# EAGLE design CurrentAmp (EAGLE 9.2.1)
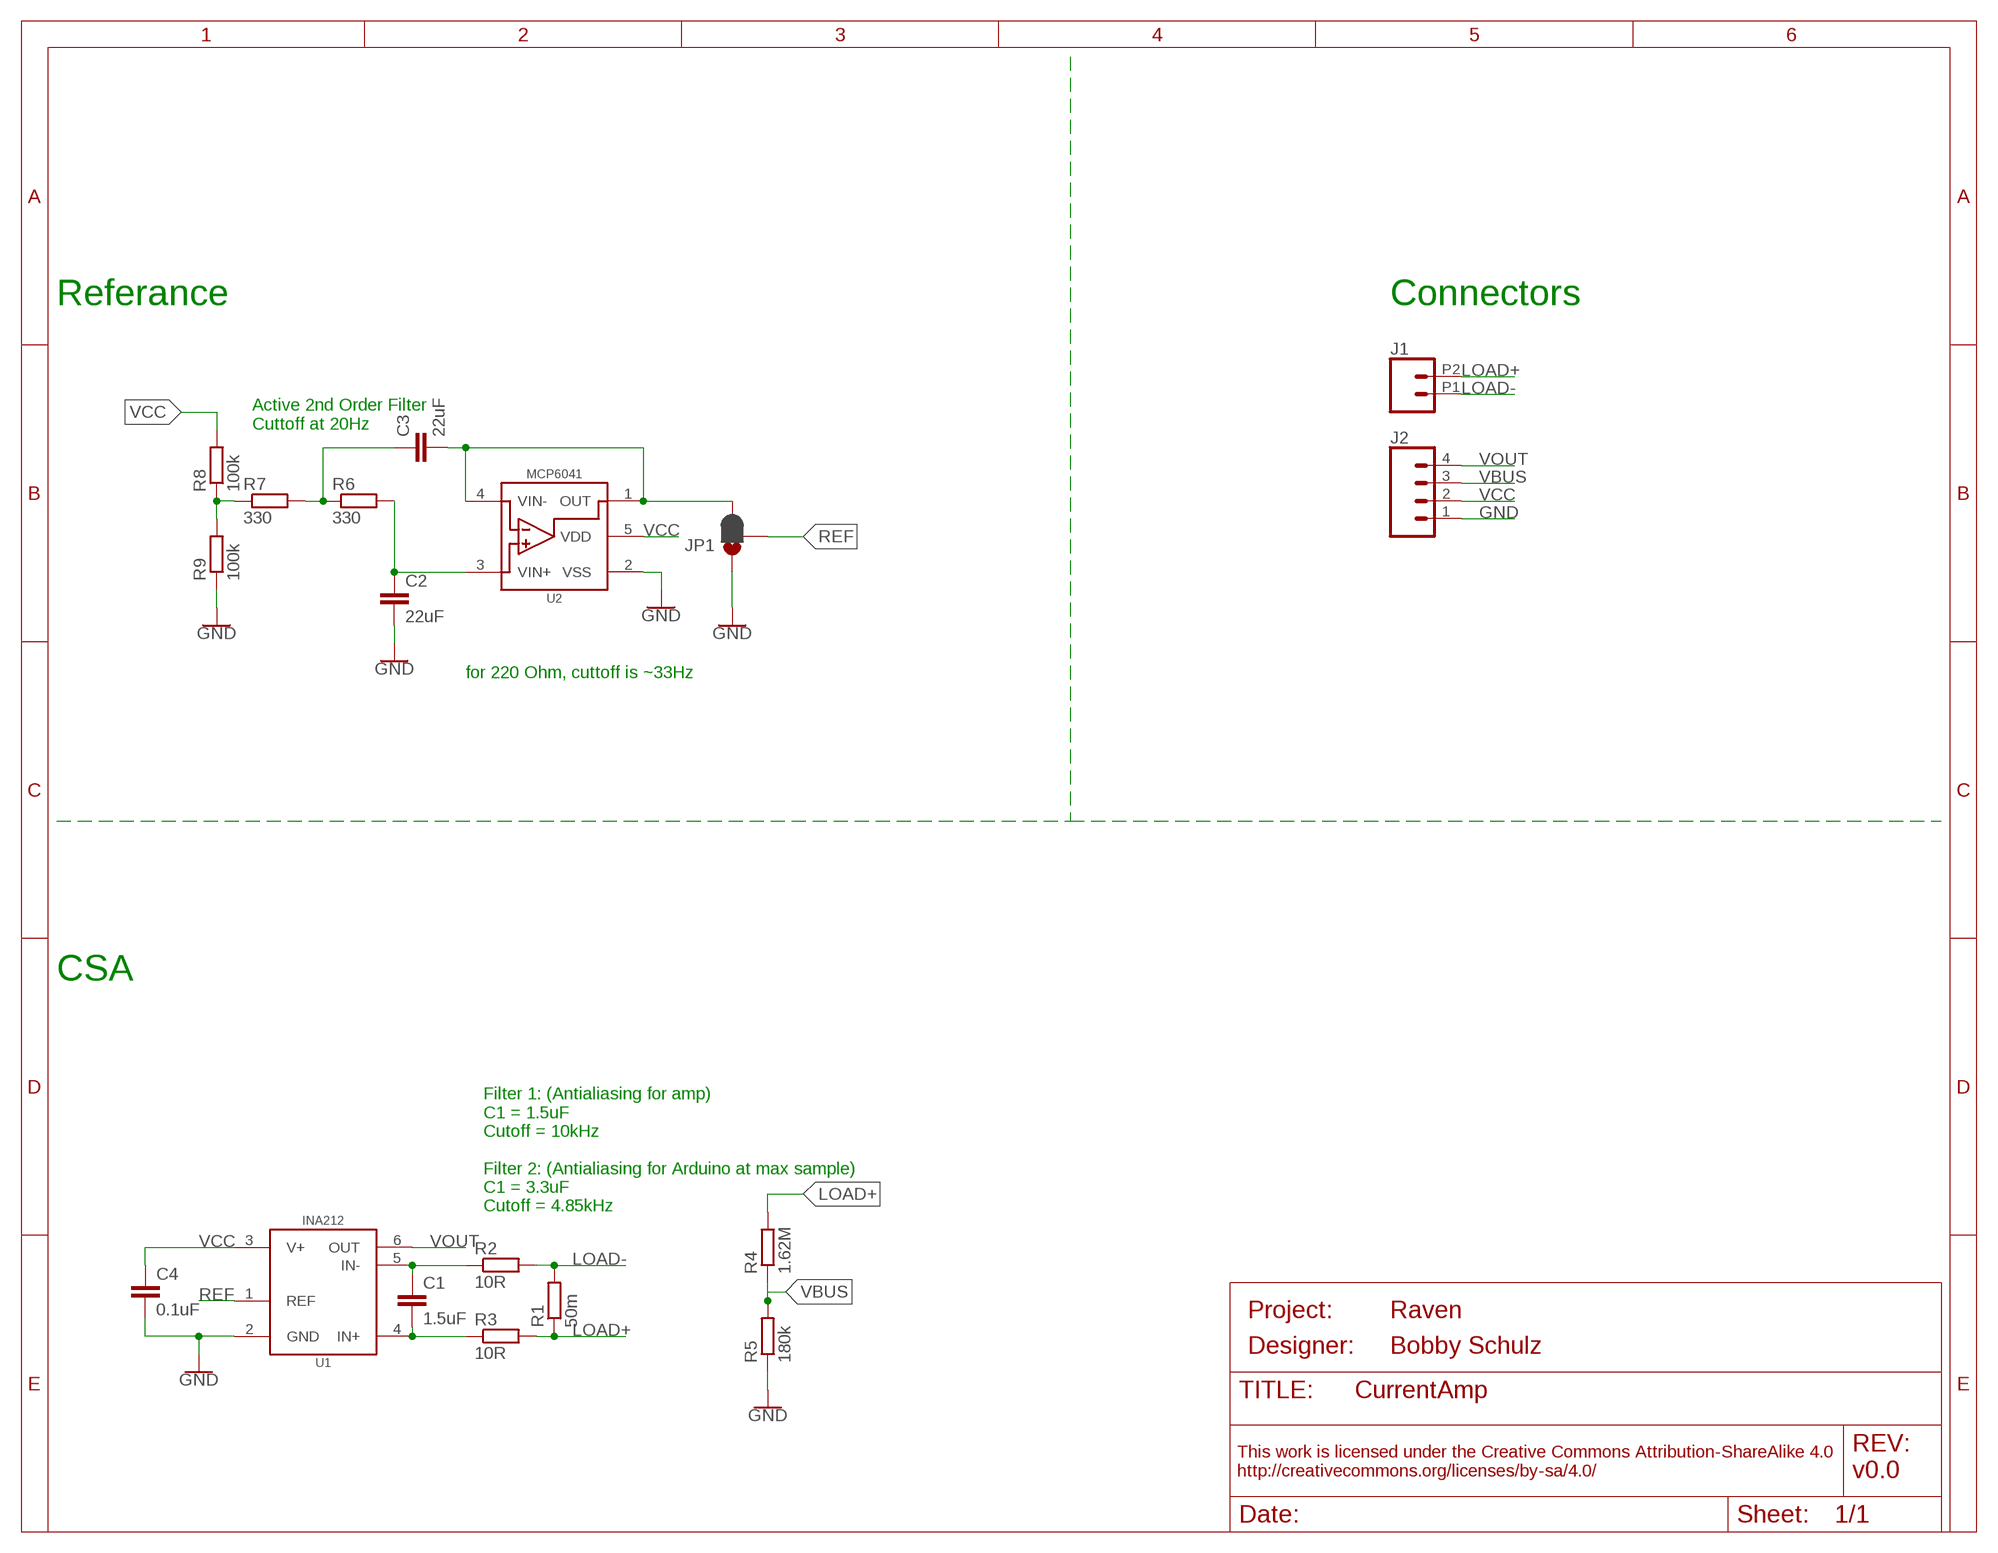
[diagram p0: schematic, sheet 1]
FRAME1 (FRAME_A_L): DESIGNER: Bobby Schulz; PROJECT: Raven; REV: v0.0

## Parts
C1  1.5uF  C-EUC0603  [C0603]
C2  22uF  C-EUC0805  [C0805]
C3  22uF  C-EUC0805  [C0805]
C4  0.1uF  C-EUC0603  [C0603]
J1  CONN_022.54MM_SCREWTERM  [1X02_2.54_SCREWTERM]
J2  CONN_42.54_SCREW  [1X04_SCREW]
JP1  JUMPER-SMT_3_1-NC_PASTE_SILK  [SMT-JUMPER_3_1-NC_PASTE_SILK]
R1  50m  R-EU_R0805  [R0805]
R2  10R  R-EU_R0603  [R0603]
R3  10R  R-EU_R0603  [R0603]
R4  1.62M  R-EU_R0603  [R0603]
R5  180k  R-EU_R0603  [R0603]
R6  330  R-EU_R0603  [R0603]
R7  330  R-EU_R0603  [R0603]
R8  100k  R-EU_R0603  [R0603]
R9  100k  R-EU_R0603  [R0603]
U1  INA212DCK  [DCK_R-PDSO-G6]
U2  MCP6041  [SOT23-5]

## Nets
GND: C2.2 C4.2 J2.1 JP1.1 R5.1 R9.1 U1.2(GND) U2.2(VSS)
LOAD+: J1.P2 R1.1 R3.2 R4.2
LOAD-: J1.P1 R1.2 R2.2
N$1: C1.1 R2.1 U1.5(IN-)
N$2: C1.2 R3.1 U1.4(IN+)
N$3: C3.2 JP1.3 U2.1(OUT) U2.4(VIN-)
N$4: C2.1 R6.2 U2.3(VIN+)
N$5: C3.1 R6.1 R7.2
N$6: R7.1 R8.1 R9.2
REF: JP1.2 U1.1(REF)
VBUS: J2.3 R4.1 R5.2
VCC: C4.1 J2.2 R8.2 U1.3(V+) U2.5(VDD)
VOUT: J2.4 U1.6(OUT)

## Notes on the sheet
- Referance | Connectors
- Active 2nd Order Filter
  Cuttoff at 20Hz
- for 220 Ohm, cuttoff is ~33Hz
- CSA
- Filter 1: (Antialiasing for amp)
  C1 = 1.5uF
  Cutoff = 10kHz 
  
  Filter 2: (Antialiasing for Arduino at max sample)
  C1 = 3.3uF
  Cutoff = 4.85kHz

## Library data of the parts
C1-C4 = bschulz_passives:C-EU: CAPACITOR, European symbol
J1 = SparkFun-Connectors:CONN_02: Multi connection point. Often used as Generic Header-pin footprint for 0.1 inch spaced/style header connections On any of the 0.1 inch spaced packages, you can populate with these: Break Away Headers - Straight <https://www.sparkfun.com/products/116> (PRT-00116) Break Away Male Headers - Right Angle <https://www.sparkfun.com/products/553> (PRT-00553) Female Headers <https://www.sparkfun.com/products/115> (PRT-00115) Break Away Headers - Machine Pin <https://www.sparkfun.com/products/117> (PRT-00117) Break Away Female Headers - Swiss Machine Pin <https://www.sparkfun.com/products/743> (PRT-00743) For SCREWTERMINALS and SPRING TERMINALS visit here: Screw Terimnals on SparkFun.com <https://www.sparkfun.com/search/results?term=Screw+Terminals> (5mm/3.5mm/2.54mm spacing) This device is also useful as a general connection point to wire up your design to another part of your project. Our various solder wires solder well into these plated through hole pads. Hook-Up Wire - Assortment (Stranded, 22 AWG) <https://www.sparkfun.com/products/11375> (PRT-11375) Hook-Up Wire - Assortment (Solid Core, 22 AWG) <https://www.sparkfun.com/products/11367> (PRT-11367) View the entire wire category on our website here <https://www.sparkfun.com/categories/141> Special notes: Molex polarized connector foot print use with: PRT-08233 with associated crimp pins and housings. 2.54_SCREWTERM for use with PRT-10571. 3.5mm Screw Terminal footprints for PRT-08084 5mm Screw Terminal footprints for use with PRT-08432
J2 = bschulz:CONN_4: Genaric 4 pin connector; DIGIKEY: ED10563-ND; MF: On Shore; MPN: OSTVN04A150
JP1 = SparkFun-Jumpers:JUMPER-SMT_3_1-NC_PASTE: Normally closed solder jumper (1 of 2 connections) This jumper has an aperture in the stencil to allow solder paste to bridge one of the two connections. One connection is normally closed (NC), while the other is normally open (NO). Wick off the solder to open the connection. Reapply solder to reclose the connection. Apply solder to the other side instead to change the current path.
R1 = bschulz_passives:R-EU_: RESISTOR, European symbol Digikey Parts: Yageo, 0402 <https://www.digikey.com/products/en/resistors/chip-resistor-surface-mount/52?k=&pkeyword=&sf=0&FV=ffec1104%2Cfffc000d%2C1c0002%2C440067%2C1f140000%2Cffe00034%2C400004&quantity=&ColumnSort=0&page=1&stock=1&pageSize=25> Yageo, 0603 <https://www.digikey.com/products/en/resistors/chip-resistor-surface-mount/52?k=&pkeyword=&s=4356&s=47360&sf=0&FV=fffc000d%2C1c0002%2C142c040c%2C1f140000%2Cffe00034&quantity=10&ColumnSort=1000011&page=1&stock=1&pageSize=25> Panasonic, 0603 <https://www.digikey.com/products/en/resistors/chip-resistor-surface-mount/52?k=&pkeyword=&pv252=68&sf=0&FV=ffec373d%2C1c0002%2C142c040c%2C1f140000%2Cffe00034%2C80002%2Cc0001&quantity=&ColumnSort=0&page=1&stock=1&pageSize=25> Panasonic, precision, 0603 <https://www.digikey.com/products/en/resistors/chip-resistor-surface-mount/52?FV=ffec4907%2Cfffc000a%2Cc0172%2C142c040c%2C1f140000%2Cffe00034%2C1c0002&quantity=100&ColumnSort=2085&page=1&stock=1&pageSize=25> Panasonic, 0805 <https://www.digikey.com/products/en/resistors/chip-resistor-surface-mount/52?k=&pkeyword=&pv3=1&sf=0&FV=ffec373d%2C1c0002%2C1f140000%2Cffe00034%2C142c040d&quantity=&ColumnSort=0&page=1&stock=1&pageSize=25> Rohm, current sense <https://www.digikey.com/products/en/resistors/chip-resistor-surface-mount/52?k=&pkeyword=&pv3=1&sf=0&FV=ffecb688%2C1f140000%2Cffe00034%2C1c0002&quantity=&ColumnSort=0&page=1&stock=1&pageSize=25> Vishay, pulse proof automotive <https://www.digikey.com/products/en/resistors/chip-resistor-surface-mount/52?k=&pkeyword=&pv7=2&sf=0&FV=ffec5d6b%2Cffe00034%2C1f140000&quantity=&ColumnSort=0&page=1&stock=1&pageSize=25>
R2-R9 = bschulz_passives:R-EU_: RESISTOR, European symbol Digikey Parts: Yageo, 0402 <https://www.digikey.com/products/en/resistors/chip-resistor-surface-mount/52?k=&pkeyword=&sf=0&FV=ffec1104%2Cfffc000d%2C1c0002%2C440067%2C1f140000%2Cffe00034%2C400004&quantity=&ColumnSort=0&page=1&stock=1&pageSize=25> Yageo, 0603 <https://www.digikey.com/products/en/resistors/chip-resistor-surface-mount/52?k=&pkeyword=&s=4356&s=47360&sf=0&FV=fffc000d%2C1c0002%2C142c040c%2C1f140000%2Cffe00034&quantity=10&ColumnSort=1000011&page=1&stock=1&pageSize=25> Panasonic, 0603 <https://www.digikey.com/products/en/resistors/chip-resistor-surface-mount/52?k=&pkeyword=&pv252=68&sf=0&FV=ffec373d%2C1c0002%2C142c040c%2C1f140000%2Cffe00034%2C80002%2Cc0001&quantity=&ColumnSort=0&page=1&stock=1&pageSize=25> Panasonic, precision, 0603 <https://www.digikey.com/products/en/resistors/chip-resistor-surface-mount/52?FV=ffec4907%2Cfffc000a%2Cc0172%2C142c040c%2C1f140000%2Cffe00034%2C1c0002&quantity=100&ColumnSort=2085&page=1&stock=1&pageSize=25> Panasonic, 0805 <https://www.digikey.com/products/en/resistors/chip-resistor-surface-mount/52?k=&pkeyword=&pv3=1&sf=0&FV=ffec373d%2C1c0002%2C1f140000%2Cffe00034%2C142c040d&quantity=&ColumnSort=0&page=1&stock=1&pageSize=25> Rohm, current sense <https://www.digikey.com/products/en/resistors/chip-resistor-surface-mount/52?k=&pkeyword=&pv3=1&sf=0&FV=ffecb688%2C1f140000%2Cffe00034%2C1c0002&quantity=&ColumnSort=0&page=1&stock=1&pageSize=25> Vishay, pulse proof automotive <https://www.digikey.com/products/en/resistors/chip-resistor-surface-mount/52?k=&pkeyword=&pv7=2&sf=0&FV=ffec5d6b%2Cffe00034%2C1f140000&quantity=&ColumnSort=0&page=1&stock=1&pageSize=25>; MF: Yageo
U1 = bschulz:INA21*: INA21x - Analog Output Current Sense Amplifier Characteristics: Vs: 2.7V ~ 26V Iq: 100uA Common Mode Range: 0V ~ 26V Gain: 200, 500, 1000, 50, 100, 75 V/V (INA210, 211, 212, 213, 214, 215) Operating Temperature: -40°C to 125°C Digikey: INA210 <https://www.digikey.com/product-detail/en/texas-instruments/INA210BIDCKR/296-40124-1-ND/5178001> INA211 <https://www.digikey.com/product-detail/en/texas-instruments/INA211BIDCKR/296-40126-1-ND/5178003> INA212 <https://www.digikey.com/product-detail/en/texas-instruments/INA212BIDCKR/296-40128-1-ND/5178005> INA213 <https://www.digikey.com/product-detail/en/texas-instruments/INA213BIDCKR/296-40129-1-ND/5178006> INA214 <https://www.digikey.com/product-detail/en/texas-instruments/INA214BIDCKR/296-40131-1-ND/5178008> INA215 <https://www.digikey.com/product-detail/en/texas-instruments/INA215AIDCKR/296-46095-1-ND/7033271>; DIGIKEY: 296-40128-1-ND; DISP: INA212; MF: TI; MPN: INA212BIDCKR
U2 = bschulz:MCP6041: MCP6041 - Low Power Rail to Rail Op-Amp Characteristics: Vs: 1.4V ~ 6V Iq: 600nA Common Mode Range: 0V ~ 6V GBP: 14 kHz Operating Temperature: -40°C to 125°C Digikey: MCP6041T-I/OTCT-ND <https://www.digikey.com/product-detail/en/microchip-technology/MCP6041T-I-OT/MCP6041T-I-OTCT-ND/529846>; DIGIKEY: MCP6041T-I/OTCT-ND; DISP: MCP6041; MF: Microchip; MPN: MCP6041T-I/OT

## Board
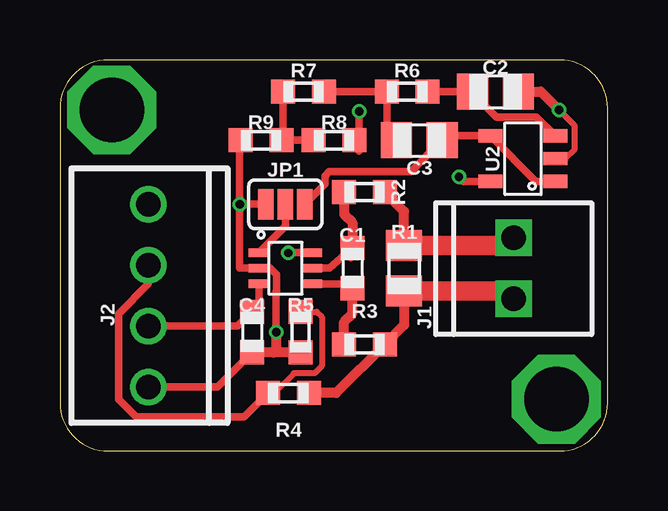
[diagram p1: board, top side]
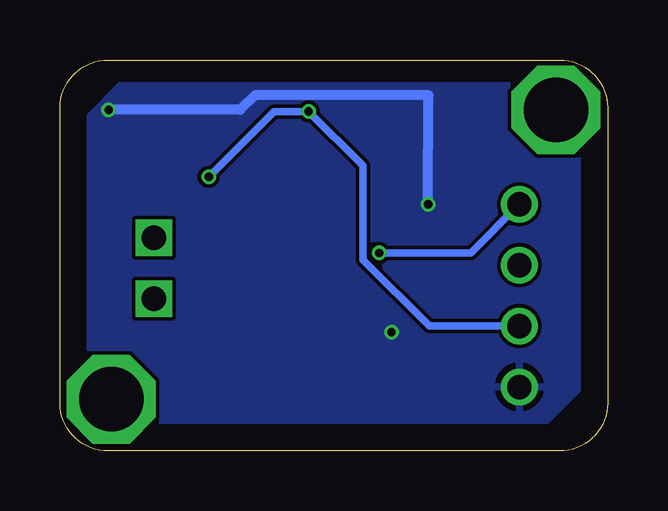
[diagram p2: board, bottom side, seen from below]

Size 22.84 x 16.31 mm. Coordinates in mm from the lower left corner, seen from the top.
Outline: 0,14.31 0,2 arc90 2,0 20.84,0 arc90 22.84,2 22.84,14.31 arc90 20.84,16.31 2,16.31 arc90 0,14.31
Copper layers (1*16): Top 0.035559375mm / dielectric 1.6mm / Bottom 0.035559375mm
Design rules "oshpark-2layer": minimum track width 6mil, minimum drill 10mil, track to track 6mil, track to pad 6mil, pad to pad 6mil, via to via 6mil, smd to smd 6mil, copper to edge 15mil, drill to drill 6mil, minimum pad ring 5mil, minimum via ring 5mil, stop-mask expansion 2.5mil, vias tented up to drill 0mil, thermal gap 10mil

### Footprints (pad centres in the part's own frame; a part is rotated, then mirrored left to right if it is on the bottom)
C0603 = smd 1 x 1: 1 -0.85,0; 2 0.85,0
C0805 = smd 1.3 x 1.5: 1 -0.95,0; 2 0.95,0
1X02_2.54_SCREWTERM = drill 1.016 square: P1 2.54,0; P2 0,0
1X04_SCREW = drill 1.016: 1 -3.81,0; 2 -1.27,0; 3 1.27,0; 4 3.81,0
SMT-JUMPER_3_1-NC_PASTE_SILK = smd 0.635 x 1.27: 1 -0.813,0; 2 0,0; 3 0.813,0
R0805 = smd 1.3 x 1.5: 1 -0.95,0; 2 0.95,0
R0603 = smd 1 x 1: 1 -0.85,0; 2 0.85,0
DCK_R-PDSO-G6 = smd 0.35 x 0.85: 1 -0.65,-1.1; 2 0,-1.1; 3 0.65,-1.1; 4 0.65,1.1; 5 0,1.1; 6 -0.65,1.1
SOT23-5 = smd 0.55 x 1: 1 -0.95,-1.35; 2 0,-1.35; 3 0.95,-1.35; 4 0.95,1.35; 5 -0.95,1.35

### Placement (x,y rotation side)
C1  12.19,7.62 270 top
C2  18.16,14.99 0 top
C3  14.99,12.95 0 top
C4  8,4.95 270 top
J1  18.92,6.35 90 top
J2  3.68,6.48 90 top
JP1  9.4,10.29 0 top
R1  14.35,7.62 90 top
R2  12.7,10.79 0 top
R3  12.7,4.45 0 top
R4  9.53,2.41 0 top
R5  10.03,4.95 90 top
R6  14.48,14.99 0 top
R7  10.16,14.99 0 top
R8  11.43,12.95 0 top
R9  8.38,12.95 0 top
U1  9.4,7.62 270 top
U2  19.3,12.19 90 top

### Tracks (layer width: path | path; a pad name or v marks a point on that pad's centre or on a via)
GND  (via drill 0.35)
  Top 0.254: U2.2 21.08,12.19 21.46,12.57 21.46,13.57 v20.81,14.22
  Top 0.305: JP1.1 7.62,10.29 | R9.1 7.49,12.45 v7.49,10.29 7.49,7.62 U1.2 8.76,7.62 9.03,7.36 9.03,6.67 9.02,6.66 v9.02,4.95 9.02,4.87 | J2.1 6.57,2.67 C4.2 | 20.91,12.19 U2.2
  Top 0.406: R5.1 8.89,4.1 | 8.89,4.1 C4.2 | v9.02,4.95 9.02,4.23 arc-90 8.89,4.1 | 7.62,10.29 v7.49,10.29 | C2.2 20.05,14.99 v20.81,14.22
  Bottom 0.406: v7.49,10.29 7.47,14.84 14.71,14.84 15.32,14.22 v20.81,14.22
  pour Bottom: 1.27,13.97 2.54,15.24 20.32,15.24 21.59,13.97 21.59,2.54 20.32,1.27 2.54,1.27 1.27,2.54
LOAD+
  Top 0.406: R1.1 14.35,5.25 R3.2 11.52,2.41 R4.2
  Top 0.813: R1.1 18.6,6.67 J1.P2
LOAD-
  Top 0.406: R1.2 14.35,9.99 R2.2
  Top 0.813: J1.P1 18.6,8.57 R1.2
N$1
  Top 0.305: C1.1 11.24,7.62 U1.5
  Top 0.406: C1.1 12.13,8.13 12.19,8.19 12.19,9.53 11.85,9.87 R2.1
N$2
  Top 0.305: C1.2 arc90 11.89,6.97 U1.4
  Top 0.406: R3.1 11.85,5.37 12.19,5.71 C1.2
N$3
  Top 0.305: U2.1 19.85,11.24 U2.4 16.12,13.14 C3.2 14.63,11.65 11.22,11.65 11.04,11.47 11.04,11.12 JP1.3 10.24,10.29
  Top 0.406: C3.2
N$4
  Top 0.305: U2.3 19.86,13.93 18.21,13.93 17.15,14.99 C2.1 R6.2
N$5
  Top 0.305: C3.1 13.63,13.36 R6.1 R7.2
N$6
  Top 0.305: R8.1 R9.2 9.31,13.03 R7.1
N$7  (via drill 2.69 pad 2.5)
  other vias: 2.16,14.22
N$8  (via drill 2.69)
  other vias: 20.7,2.16
REF
  Top 0.305: U1.1 9.4,9.37 JP1.2
VBUS
  Top 0.254: R5.2 10.71,5.8 10.92,5.59 10.92,3.55 10.62,3.24 9.76,3.24 8.93,2.41 R4.1
  Top 0.305: J2.3 3.68,6.97 2.44,5.72 2.44,2.15 3.17,1.42 7.68,1.42 R4.1
VCC  (via drill 0.35)
  Top 0.305: U2.5 16.82,11.24 v16.64,11.43 | U1.3 8.3,6.1 C4.1 7.41,5.21 J2.2 | v12.47,14.16 12.47,12.51 R8.2
  Bottom 0.305: v16.64,11.43 13.91,14.16 v12.47,14.16 10.21,11.89 10.21,7.97 7.44,5.21 J2.2
VOUT  (via drill 0.35)
  Top 0.305: U1.6 v9.54,8.27 v9.53,8.26
  Bottom 0.305: v9.53,8.26 5.71,8.26 J2.4

### Text on the board
_tsilk: Load | Current Amp
_bsilk: Northern Widget / Bobby Schulz | Out | Load- | Vbus | Vcc | Load+ | GND